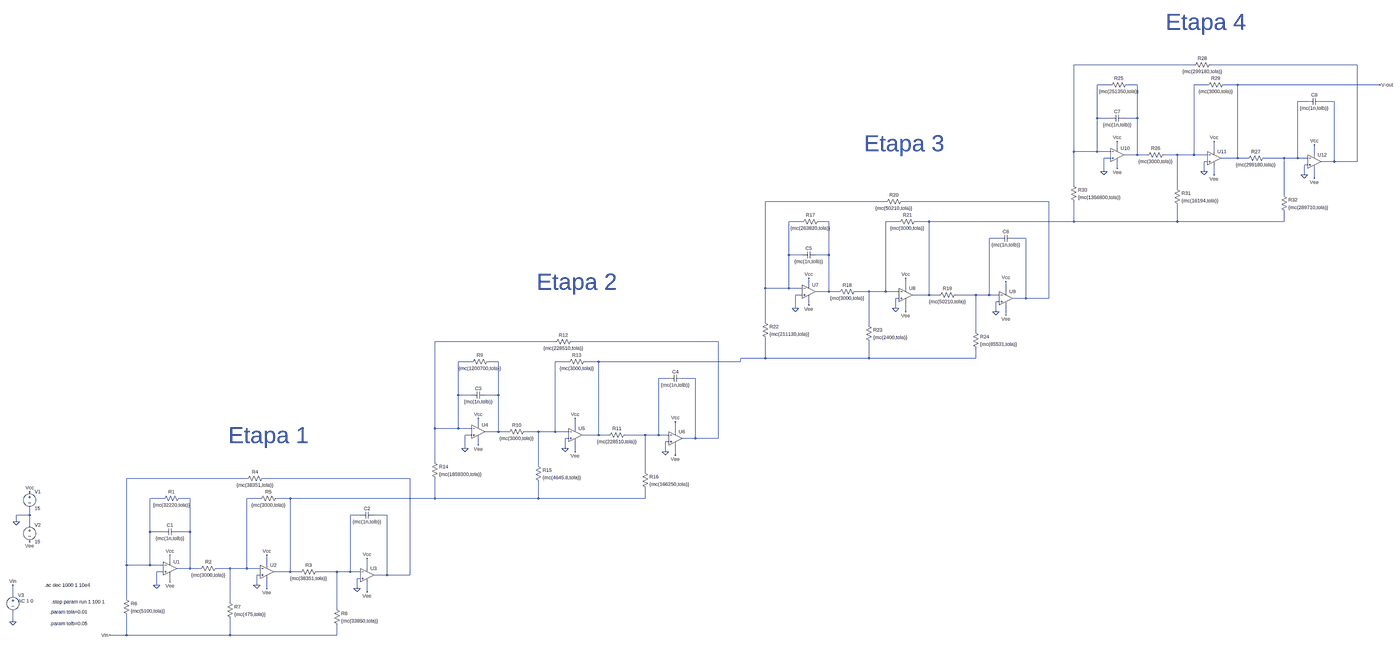
[diagram p0: schematic Draft1.asc, whole sheet]
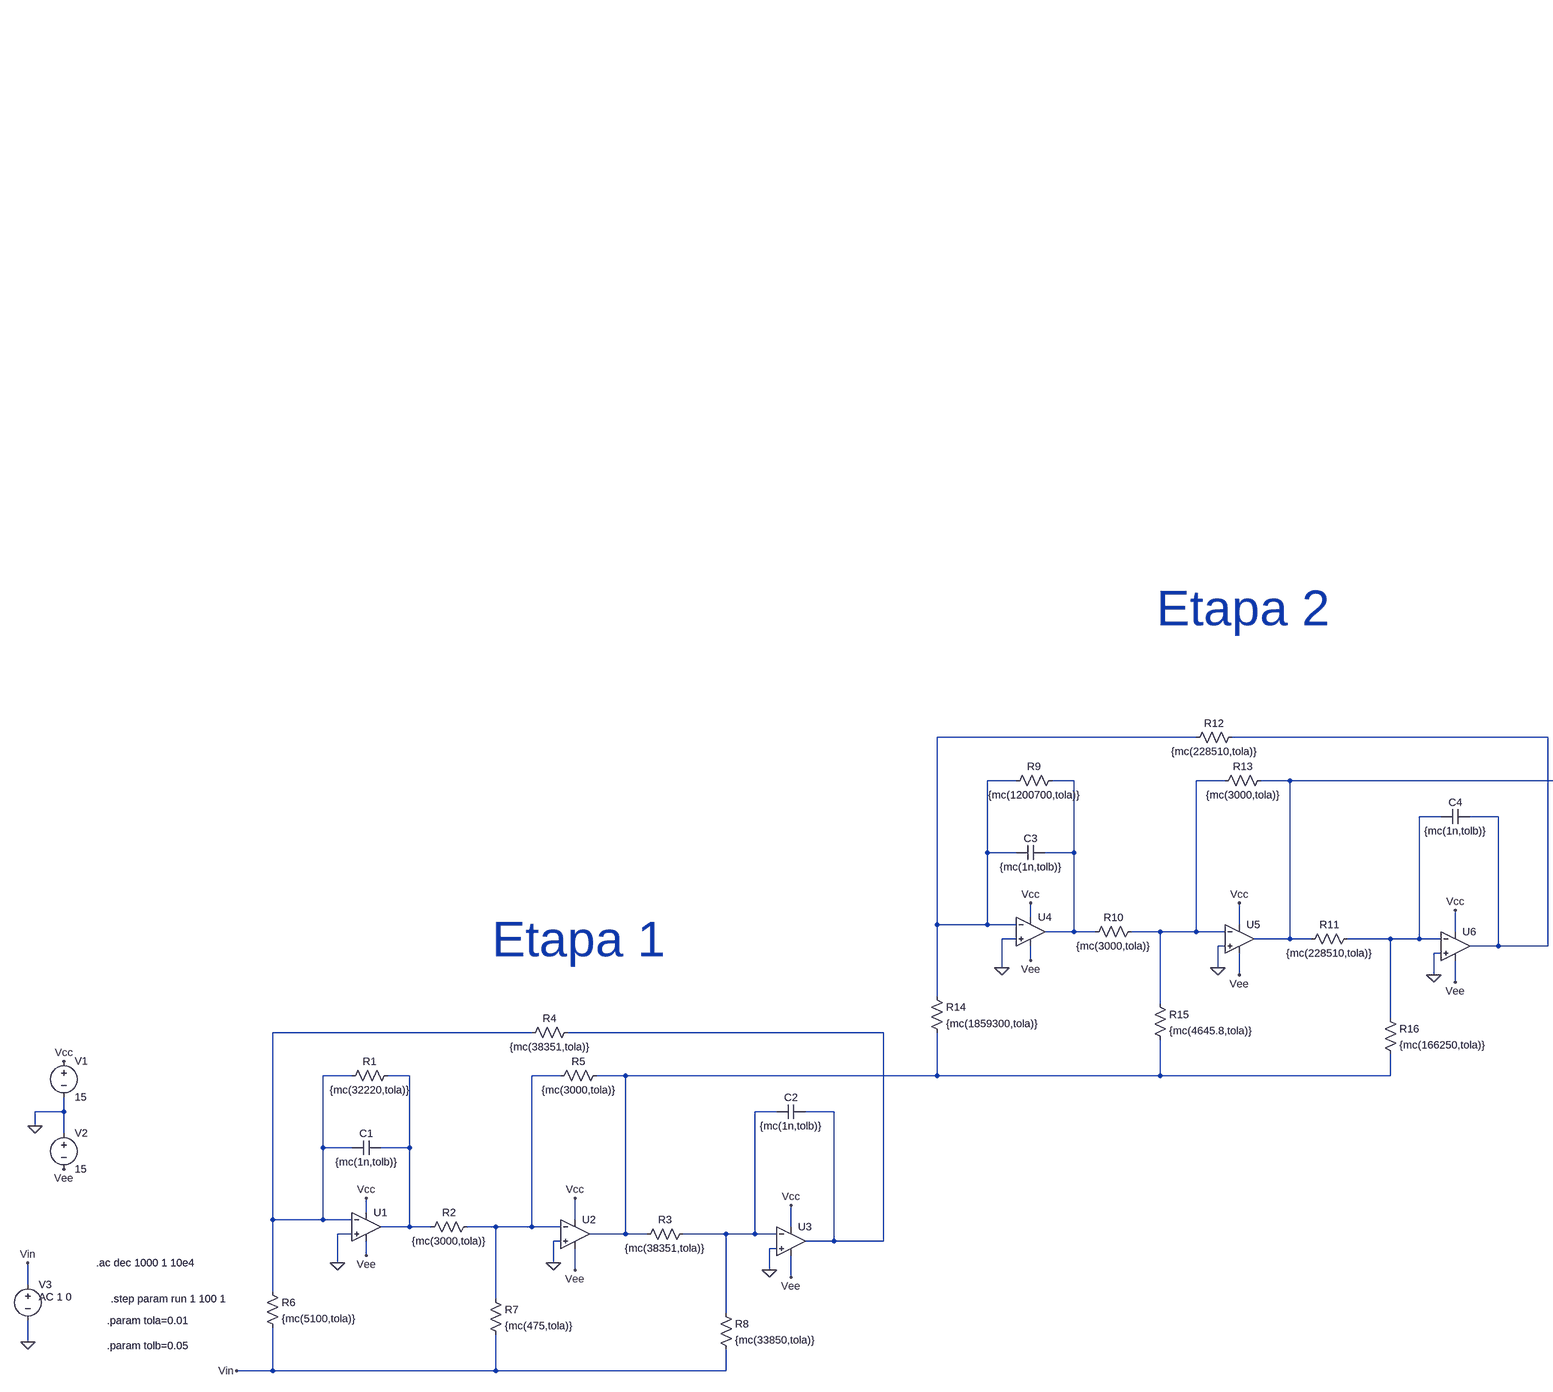
[diagram p1: schematic Draft1.asc, part, row 1 of 1, column 1 of 2]
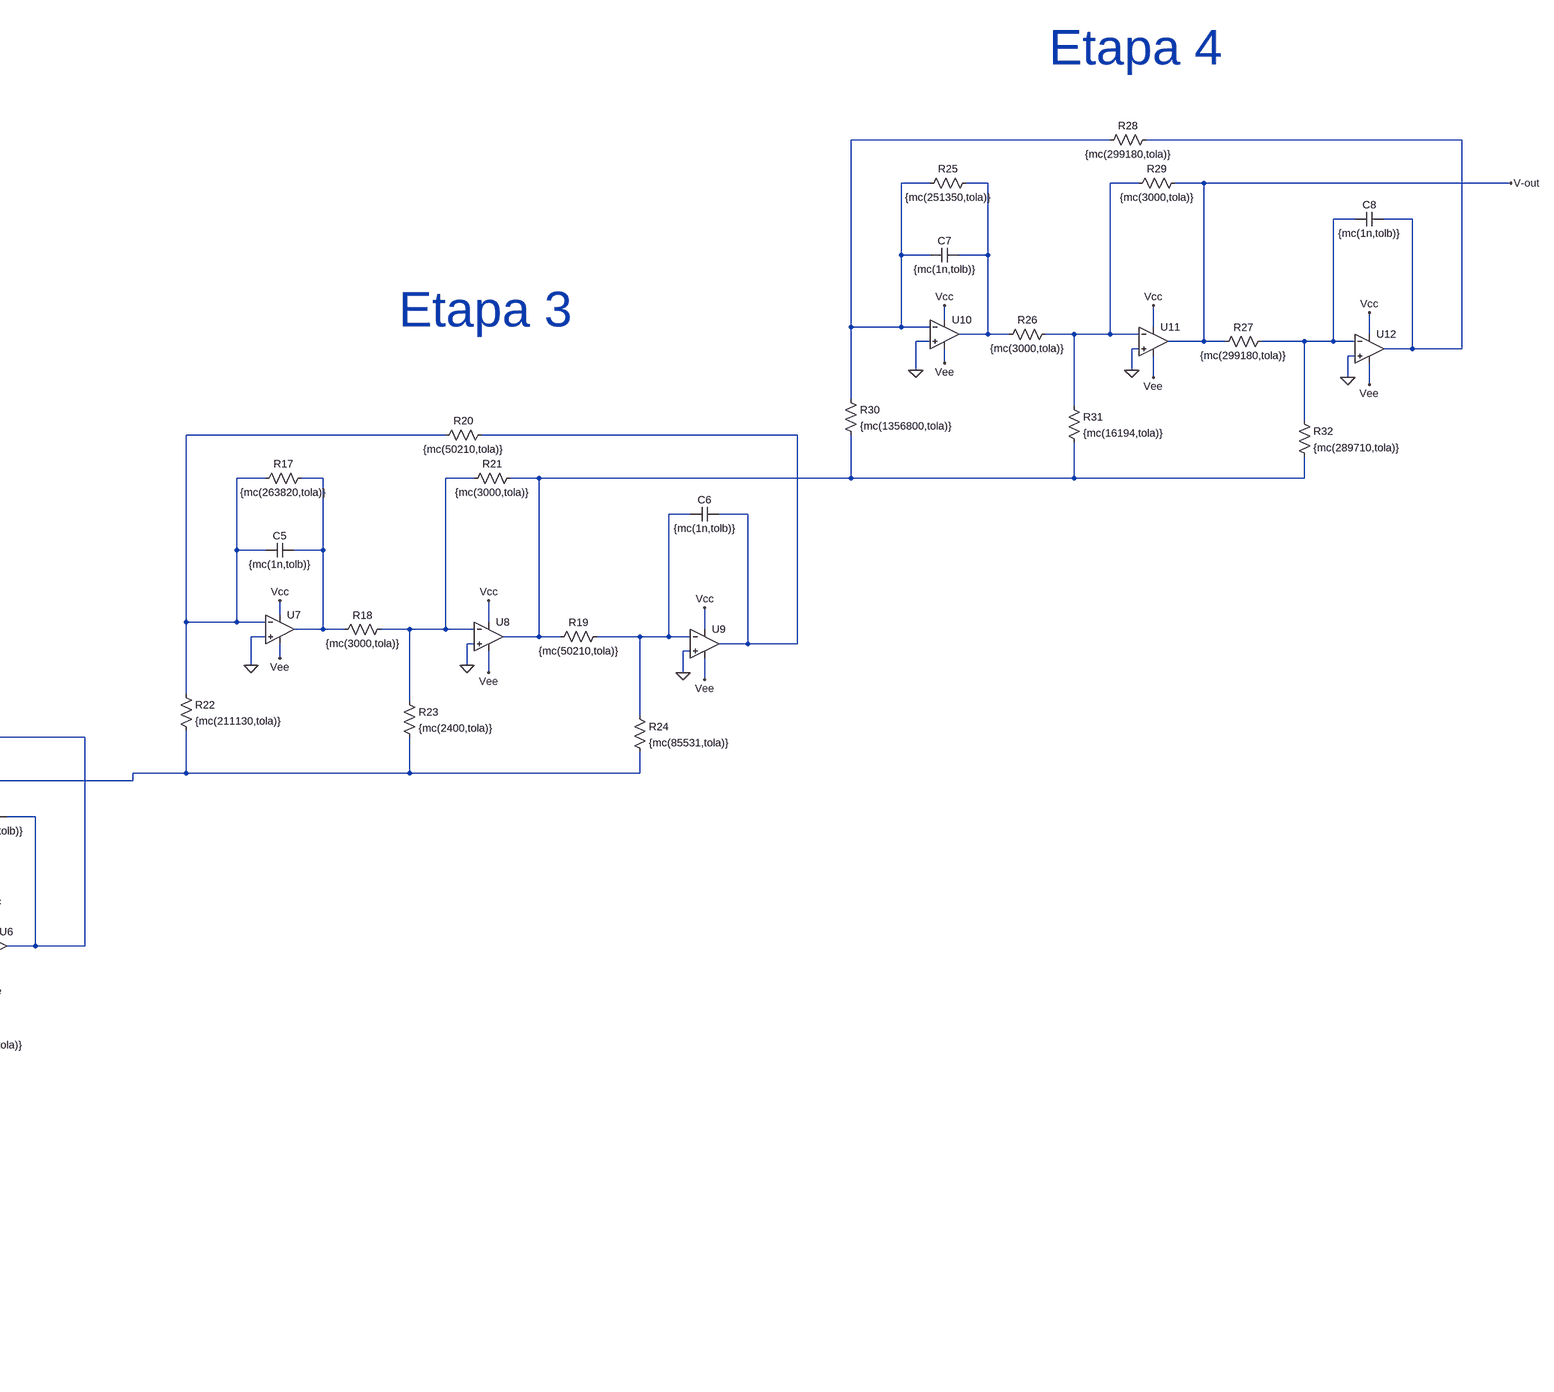
[diagram p2: schematic Draft1.asc, part, row 1 of 1, column 2 of 2]
Draft1.asc, the LTspice schematic file:
Version 4
SHEET 1 6620 1100
WIRE 5600 -1696 5024 -1696
WIRE 6400 -1696 5680 -1696
WIRE 5200 -1600 5136 -1600
WIRE 5328 -1600 5280 -1600
WIRE 5664 -1600 5600 -1600
WIRE 5808 -1600 5744 -1600
WIRE 6544 -1600 5808 -1600
WIRE 6144 -1520 6096 -1520
WIRE 6272 -1520 6208 -1520
WIRE 5136 -1440 5136 -1600
WIRE 5200 -1440 5136 -1440
WIRE 5328 -1440 5328 -1600
WIRE 5328 -1440 5264 -1440
WIRE 5232 -1296 5232 -1328
WIRE 5024 -1280 5024 -1696
WIRE 5136 -1280 5136 -1440
WIRE 5136 -1280 5024 -1280
WIRE 5200 -1280 5136 -1280
WIRE 5696 -1280 5696 -1328
WIRE 5328 -1264 5328 -1440
WIRE 5328 -1264 5264 -1264
WIRE 5376 -1264 5328 -1264
WIRE 5520 -1264 5456 -1264
WIRE 5600 -1264 5600 -1600
WIRE 5600 -1264 5520 -1264
WIRE 5664 -1264 5600 -1264
WIRE 6176 -1264 6176 -1312
WIRE 5200 -1248 5168 -1248
WIRE 5808 -1248 5808 -1600
WIRE 5808 -1248 5728 -1248
WIRE 5856 -1248 5808 -1248
WIRE 6032 -1248 5936 -1248
WIRE 6096 -1248 6096 -1520
WIRE 6096 -1248 6032 -1248
WIRE 6144 -1248 6096 -1248
WIRE 5664 -1232 5648 -1232
WIRE 6272 -1232 6272 -1520
WIRE 6272 -1232 6208 -1232
WIRE 6400 -1232 6400 -1696
WIRE 6400 -1232 6272 -1232
WIRE 6144 -1216 6128 -1216
WIRE 5232 -1200 5232 -1232
WIRE 5168 -1184 5168 -1248
WIRE 5648 -1184 5648 -1232
WIRE 5696 -1168 5696 -1216
WIRE 6128 -1168 6128 -1216
WIRE 6176 -1152 6176 -1200
WIRE 5024 -1120 5024 -1280
WIRE 5520 -1104 5520 -1264
WIRE 6032 -1072 6032 -1248
WIRE 3568 -1040 2992 -1040
WIRE 4368 -1040 3648 -1040
WIRE 3168 -944 3104 -944
WIRE 3296 -944 3248 -944
WIRE 3632 -944 3568 -944
WIRE 3776 -944 3712 -944
WIRE 5024 -944 5024 -1040
WIRE 5024 -944 3776 -944
WIRE 5520 -944 5520 -1024
WIRE 5520 -944 5024 -944
WIRE 6032 -944 6032 -992
WIRE 6032 -944 5520 -944
WIRE 4112 -864 4064 -864
WIRE 4240 -864 4176 -864
WIRE 3104 -784 3104 -944
WIRE 3168 -784 3104 -784
WIRE 3296 -784 3296 -944
WIRE 3296 -784 3232 -784
WIRE 3200 -640 3200 -672
WIRE 2992 -624 2992 -1040
WIRE 3104 -624 3104 -784
WIRE 3104 -624 2992 -624
WIRE 3168 -624 3104 -624
WIRE 3664 -624 3664 -672
WIRE 3296 -608 3296 -784
WIRE 3296 -608 3232 -608
WIRE 3344 -608 3296 -608
WIRE 3488 -608 3424 -608
WIRE 3568 -608 3568 -944
WIRE 3568 -608 3488 -608
WIRE 3632 -608 3568 -608
WIRE 4144 -608 4144 -656
WIRE 3168 -592 3136 -592
WIRE 3776 -592 3776 -944
WIRE 3776 -592 3696 -592
WIRE 3824 -592 3776 -592
WIRE 4000 -592 3904 -592
WIRE 4064 -592 4064 -864
WIRE 4064 -592 4000 -592
WIRE 4112 -592 4064 -592
WIRE 3632 -576 3616 -576
WIRE 4240 -576 4240 -864
WIRE 4240 -576 4176 -576
WIRE 4368 -576 4368 -1040
WIRE 4368 -576 4240 -576
WIRE 4112 -560 4096 -560
WIRE 3200 -544 3200 -576
WIRE 3136 -528 3136 -592
WIRE 3616 -528 3616 -576
WIRE 3664 -512 3664 -560
WIRE 4096 -512 4096 -560
WIRE 4144 -496 4144 -544
WIRE 2992 -464 2992 -624
WIRE 3488 -448 3488 -608
WIRE 4000 -416 4000 -592
WIRE 1440 -368 864 -368
WIRE 2240 -368 1520 -368
WIRE 2992 -288 2992 -384
WIRE 2992 -288 2512 -288
WIRE 3488 -288 3488 -368
WIRE 3488 -288 2992 -288
WIRE 4000 -288 4000 -336
WIRE 4000 -288 3488 -288
WIRE 1040 -272 976 -272
WIRE 1168 -272 1120 -272
WIRE 1504 -272 1440 -272
WIRE 1648 -272 1584 -272
WIRE 2512 -272 2512 -288
WIRE 2512 -272 1648 -272
WIRE 1984 -192 1936 -192
WIRE 2112 -192 2048 -192
WIRE 976 -112 976 -272
WIRE 1040 -112 976 -112
WIRE 1168 -112 1168 -272
WIRE 1168 -112 1104 -112
WIRE 1072 32 1072 0
WIRE 864 48 864 -368
WIRE 976 48 976 -112
WIRE 976 48 864 48
WIRE 1040 48 976 48
WIRE 1536 48 1536 0
WIRE 1168 64 1168 -112
WIRE 1168 64 1104 64
WIRE 1216 64 1168 64
WIRE 1360 64 1296 64
WIRE 1440 64 1440 -272
WIRE 1440 64 1360 64
WIRE 1504 64 1440 64
WIRE 2016 64 2016 16
WIRE 1040 80 1008 80
WIRE 1648 80 1648 -272
WIRE 1648 80 1568 80
WIRE 1696 80 1648 80
WIRE 1872 80 1776 80
WIRE 1936 80 1936 -192
WIRE 1936 80 1872 80
WIRE 1984 80 1936 80
WIRE 1504 96 1488 96
WIRE 2112 96 2112 -192
WIRE 2112 96 2048 96
WIRE 2240 96 2240 -368
WIRE 2240 96 2112 96
WIRE 1984 112 1968 112
WIRE 1072 128 1072 96
WIRE 1008 144 1008 80
WIRE 1488 144 1488 96
WIRE 1536 160 1536 112
WIRE 1968 160 1968 112
WIRE 2016 176 2016 128
WIRE 864 208 864 48
WIRE 1360 224 1360 64
WIRE 1872 256 1872 80
WIRE -800 288 -1376 288
WIRE 0 288 -720 288
WIRE -1200 384 -1264 384
WIRE -1072 384 -1120 384
WIRE -736 384 -800 384
WIRE -592 384 -656 384
WIRE 864 384 864 288
WIRE 864 384 -592 384
WIRE 1360 384 1360 304
WIRE 1360 384 864 384
WIRE 1872 384 1872 336
WIRE 1872 384 1360 384
WIRE -1840 464 -1840 432
WIRE -1840 464 -1904 464
WIRE -256 464 -304 464
WIRE -128 464 -192 464
WIRE -1904 496 -1904 464
WIRE -1840 512 -1840 464
WIRE -1264 544 -1264 384
WIRE -1200 544 -1264 544
WIRE -1072 544 -1072 384
WIRE -1072 544 -1136 544
WIRE -1168 688 -1168 656
WIRE -1376 704 -1376 288
WIRE -1264 704 -1264 544
WIRE -1264 704 -1376 704
WIRE -1200 704 -1264 704
WIRE -704 704 -704 656
WIRE -1072 720 -1072 544
WIRE -1072 720 -1136 720
WIRE -1024 720 -1072 720
WIRE -880 720 -944 720
WIRE -800 720 -800 384
WIRE -800 720 -880 720
WIRE -736 720 -800 720
WIRE -224 720 -224 672
WIRE -1200 736 -1232 736
WIRE -592 736 -592 384
WIRE -592 736 -672 736
WIRE -544 736 -592 736
WIRE -368 736 -464 736
WIRE -304 736 -304 464
WIRE -304 736 -368 736
WIRE -256 736 -304 736
WIRE -736 752 -752 752
WIRE -128 752 -128 464
WIRE -128 752 -192 752
WIRE 0 752 0 288
WIRE 0 752 -128 752
WIRE -256 768 -272 768
WIRE -1168 784 -1168 752
WIRE -1232 800 -1232 736
WIRE -752 800 -752 752
WIRE -704 816 -704 768
WIRE -272 816 -272 768
WIRE -224 832 -224 784
WIRE -1920 848 -1920 800
WIRE -1376 864 -1376 704
WIRE -880 880 -880 720
WIRE -368 912 -368 736
WIRE -1920 976 -1920 928
WIRE -1376 1040 -1376 944
WIRE -1376 1040 -1456 1040
WIRE -880 1040 -880 960
WIRE -880 1040 -1376 1040
WIRE -368 1040 -368 992
WIRE -368 1040 -880 1040
FLAG -272 816 0
FLAG -752 800 0
FLAG -1168 656 Vcc
FLAG -704 656 Vcc
FLAG -224 672 Vcc
FLAG -1168 784 Vee
FLAG -704 816 Vee
FLAG -224 832 Vee
FLAG -1840 352 Vcc
FLAG -1840 592 Vee
FLAG -1904 496 0
FLAG -1920 976 0
FLAG -1920 800 Vin
FLAG -1232 800 0
FLAG -1456 1040 Vin
FLAG 1968 160 0
FLAG 1488 144 0
FLAG 1072 0 Vcc
FLAG 1536 0 Vcc
FLAG 2016 16 Vcc
FLAG 1072 128 Vee
FLAG 1536 160 Vee
FLAG 2016 176 Vee
FLAG 1008 144 0
FLAG 4096 -512 0
FLAG 3616 -528 0
FLAG 3200 -672 Vcc
FLAG 3664 -672 Vcc
FLAG 4144 -656 Vcc
FLAG 3200 -544 Vee
FLAG 3664 -512 Vee
FLAG 4144 -496 Vee
FLAG 3136 -528 0
FLAG 6128 -1168 0
FLAG 5648 -1184 0
FLAG 6544 -1600 V-out
FLAG 5232 -1328 Vcc
FLAG 5696 -1328 Vcc
FLAG 6176 -1312 Vcc
FLAG 5232 -1200 Vee
FLAG 5696 -1168 Vee
FLAG 6176 -1152 Vee
FLAG 5168 -1184 0
SYMBOL Opamps\\UniversalOpamp2 -1168 720 R0
SYMATTR InstName U1
SYMATTR Value2 Avol=1000Meg GBW=10000Meg Slew=1000Meg
SYMATTR SpiceLine ilimit=50 rail=0 Vos=0 phimargin=45
SYMATTR SpiceLine2 en=0 enk=0 in=0 ink=0 Rin=100000Meg
SYMBOL Opamps\\UniversalOpamp2 -704 736 R0
SYMATTR InstName U2
SYMATTR Value2 Avol=1000Meg GBW=10000Meg Slew=1000Meg
SYMATTR SpiceLine ilimit=50 rail=0 Vos=0 phimargin=45
SYMATTR SpiceLine2 en=0 enk=0 in=0 ink=0 Rin=100000Meg
SYMBOL Opamps\\UniversalOpamp2 -224 752 R0
SYMATTR InstName U3
SYMATTR Value2 Avol=1000Meg GBW=10000Meg Slew=1000Meg
SYMATTR SpiceLine ilimit=50 rail=0 Vos=0 phimargin=45
SYMATTR SpiceLine2 en=0 enk=0 in=0 ink=0 Rin=100000Meg
SYMBOL res -1104 368 R90
WINDOW 0 0 56 VBottom 2
WINDOW 3 32 56 VTop 2
SYMATTR InstName R1
SYMATTR Value {mc(32220,tola)}
SYMBOL res -928 704 R90
WINDOW 0 0 56 VBottom 2
WINDOW 3 32 56 VTop 2
SYMATTR InstName R2
SYMATTR Value {mc(3000,tola)}
SYMBOL res -448 720 R90
WINDOW 0 0 56 VBottom 2
WINDOW 3 32 56 VTop 2
SYMATTR InstName R3
SYMATTR Value {mc(38351,tola)}
SYMBOL voltage -1840 336 R0
WINDOW 123 0 0 Left 2
WINDOW 39 0 0 Left 2
SYMATTR InstName V1
SYMATTR Value 15
SYMBOL voltage -1840 496 R0
WINDOW 123 0 0 Left 2
WINDOW 39 0 0 Left 2
SYMATTR InstName V2
SYMATTR Value 15
SYMBOL voltage -1920 832 R0
WINDOW 123 24 44 Left 2
WINDOW 39 0 0 Left 2
SYMATTR Value2 AC 1 0
SYMATTR InstName V3
SYMATTR Value ""
SYMBOL cap -1136 528 R90
WINDOW 0 0 32 VBottom 2
WINDOW 3 32 32 VTop 2
SYMATTR InstName C1
SYMATTR Value {mc(1n,tolb)}
SYMBOL res -704 272 R90
WINDOW 0 0 56 VBottom 2
WINDOW 3 32 56 VTop 2
SYMATTR InstName R4
SYMATTR Value {mc(38351,tola)}
SYMBOL res -640 368 R90
WINDOW 0 0 56 VBottom 2
WINDOW 3 32 56 VTop 2
SYMATTR InstName R5
SYMATTR Value {mc(3000,tola)}
SYMBOL cap -192 448 R90
WINDOW 0 0 32 VBottom 2
WINDOW 3 32 32 VTop 2
SYMATTR InstName C2
SYMATTR Value {mc(1n,tolb)}
SYMBOL res -1392 848 R0
SYMATTR InstName R6
SYMATTR Value {mc(5100,tola)}
SYMBOL res -896 864 R0
SYMATTR InstName R7
SYMATTR Value {mc(475,tola)}
SYMBOL res -384 896 R0
SYMATTR InstName R8
SYMATTR Value {mc(33850,tola)}
SYMBOL Opamps\\UniversalOpamp2 1072 64 R0
SYMATTR InstName U4
SYMATTR Value2 Avol=1000Meg GBW=10000Meg Slew=1000Meg
SYMATTR SpiceLine ilimit=50 rail=0 Vos=0 phimargin=45
SYMATTR SpiceLine2 en=0 enk=0 in=0 ink=0 Rin=100000Meg
SYMBOL Opamps\\UniversalOpamp2 1536 80 R0
SYMATTR InstName U5
SYMATTR Value2 Avol=1000Meg GBW=10000Meg Slew=1000Meg
SYMATTR SpiceLine ilimit=50 rail=0 Vos=0 phimargin=45
SYMATTR SpiceLine2 en=0 enk=0 in=0 ink=0 Rin=100000Meg
SYMBOL Opamps\\UniversalOpamp2 2016 96 R0
SYMATTR InstName U6
SYMATTR Value2 Avol=1000Meg GBW=10000Meg Slew=1000Meg
SYMATTR SpiceLine ilimit=50 rail=0 Vos=0 phimargin=45
SYMATTR SpiceLine2 en=0 enk=0 in=0 ink=0 Rin=100000Meg
SYMBOL res 1136 -288 R90
WINDOW 0 0 56 VBottom 2
WINDOW 3 32 56 VTop 2
SYMATTR InstName R9
SYMATTR Value {mc(1200700,tola)}
SYMBOL res 1312 48 R90
WINDOW 0 0 56 VBottom 2
WINDOW 3 32 56 VTop 2
SYMATTR InstName R10
SYMATTR Value {mc(3000,tola)}
SYMBOL res 1792 64 R90
WINDOW 0 0 56 VBottom 2
WINDOW 3 32 56 VTop 2
SYMATTR InstName R11
SYMATTR Value {mc(228510,tola)}
SYMBOL cap 1104 -128 R90
WINDOW 0 0 32 VBottom 2
WINDOW 3 32 32 VTop 2
SYMATTR InstName C3
SYMATTR Value {mc(1n,tolb)}
SYMBOL res 1536 -384 R90
WINDOW 0 0 56 VBottom 2
WINDOW 3 32 56 VTop 2
SYMATTR InstName R12
SYMATTR Value {mc(228510,tola)}
SYMBOL res 1600 -288 R90
WINDOW 0 0 56 VBottom 2
WINDOW 3 32 56 VTop 2
SYMATTR InstName R13
SYMATTR Value {mc(3000,tola)}
SYMBOL cap 2048 -208 R90
WINDOW 0 0 32 VBottom 2
WINDOW 3 32 32 VTop 2
SYMATTR InstName C4
SYMATTR Value {mc(1n,tolb)}
SYMBOL res 848 192 R0
SYMATTR InstName R14
SYMATTR Value {mc(1859300,tola)}
SYMBOL res 1344 208 R0
SYMATTR InstName R15
SYMATTR Value {mc(4645.8,tola)}
SYMBOL res 1856 240 R0
SYMATTR InstName R16
SYMATTR Value {mc(166250,tola)}
SYMBOL Opamps\\UniversalOpamp2 3200 -608 R0
SYMATTR InstName U7
SYMATTR Value2 Avol=1000Meg GBW=10000Meg Slew=1000Meg
SYMATTR SpiceLine ilimit=50 rail=0 Vos=0 phimargin=45
SYMATTR SpiceLine2 en=0 enk=0 in=0 ink=0 Rin=100000Meg
SYMBOL Opamps\\UniversalOpamp2 3664 -592 R0
SYMATTR InstName U8
SYMATTR Value2 Avol=1000Meg GBW=10000Meg Slew=1000Meg
SYMATTR SpiceLine ilimit=50 rail=0 Vos=0 phimargin=45
SYMATTR SpiceLine2 en=0 enk=0 in=0 ink=0 Rin=100000Meg
SYMBOL Opamps\\UniversalOpamp2 4144 -576 R0
SYMATTR InstName U9
SYMATTR Value2 Avol=1000Meg GBW=10000Meg Slew=1000Meg
SYMATTR SpiceLine ilimit=50 rail=0 Vos=0 phimargin=45
SYMATTR SpiceLine2 en=0 enk=0 in=0 ink=0 Rin=100000Meg
SYMBOL res 3264 -960 R90
WINDOW 0 0 56 VBottom 2
WINDOW 3 32 56 VTop 2
SYMATTR InstName R17
SYMATTR Value {mc(263820,tola)}
SYMBOL res 3440 -624 R90
WINDOW 0 0 56 VBottom 2
WINDOW 3 32 56 VTop 2
SYMATTR InstName R18
SYMATTR Value {mc(3000,tola)}
SYMBOL res 3920 -608 R90
WINDOW 0 0 56 VBottom 2
WINDOW 3 32 56 VTop 2
SYMATTR InstName R19
SYMATTR Value {mc(50210,tola)}
SYMBOL cap 3232 -800 R90
WINDOW 0 0 32 VBottom 2
WINDOW 3 32 32 VTop 2
SYMATTR InstName C5
SYMATTR Value {mc(1n,tolb)}
SYMBOL res 3664 -1056 R90
WINDOW 0 0 56 VBottom 2
WINDOW 3 32 56 VTop 2
SYMATTR InstName R20
SYMATTR Value {mc(50210,tola)}
SYMBOL res 3728 -960 R90
WINDOW 0 0 56 VBottom 2
WINDOW 3 32 56 VTop 2
SYMATTR InstName R21
SYMATTR Value {mc(3000,tola)}
SYMBOL cap 4176 -880 R90
WINDOW 0 0 32 VBottom 2
WINDOW 3 32 32 VTop 2
SYMATTR InstName C6
SYMATTR Value {mc(1n,tolb)}
SYMBOL res 2976 -480 R0
SYMATTR InstName R22
SYMATTR Value {mc(211130,tola)}
SYMBOL res 3472 -464 R0
SYMATTR InstName R23
SYMATTR Value {mc(2400,tola)}
SYMBOL res 3984 -432 R0
SYMATTR InstName R24
SYMATTR Value {mc(85531,tola)}
SYMBOL Opamps\\UniversalOpamp2 5232 -1264 R0
SYMATTR InstName U10
SYMATTR Value2 Avol=1000Meg GBW=10000Meg Slew=1000Meg
SYMATTR SpiceLine ilimit=50 rail=0 Vos=0 phimargin=45
SYMATTR SpiceLine2 en=0 enk=0 in=0 ink=0 Rin=100000Meg
SYMBOL Opamps\\UniversalOpamp2 5696 -1248 R0
SYMATTR InstName U11
SYMATTR Value2 Avol=1000Meg GBW=10000Meg Slew=1000Meg
SYMATTR SpiceLine ilimit=50 rail=0 Vos=0 phimargin=45
SYMATTR SpiceLine2 en=0 enk=0 in=0 ink=0 Rin=100000Meg
SYMBOL Opamps\\UniversalOpamp2 6176 -1232 R0
SYMATTR InstName U12
SYMATTR Value2 Avol=1000Meg GBW=10000Meg Slew=1000Meg
SYMATTR SpiceLine ilimit=50 rail=0 Vos=0 phimargin=45
SYMATTR SpiceLine2 en=0 enk=0 in=0 ink=0 Rin=100000Meg
SYMBOL res 5296 -1616 R90
WINDOW 0 0 56 VBottom 2
WINDOW 3 32 56 VTop 2
SYMATTR InstName R25
SYMATTR Value {mc(251350,tola)}
SYMBOL res 5472 -1280 R90
WINDOW 0 0 56 VBottom 2
WINDOW 3 32 56 VTop 2
SYMATTR InstName R26
SYMATTR Value {mc(3000,tola)}
SYMBOL res 5952 -1264 R90
WINDOW 0 0 56 VBottom 2
WINDOW 3 32 56 VTop 2
SYMATTR InstName R27
SYMATTR Value {mc(299180,tola)}
SYMBOL cap 5264 -1456 R90
WINDOW 0 0 32 VBottom 2
WINDOW 3 32 32 VTop 2
SYMATTR InstName C7
SYMATTR Value {mc(1n,tolb)}
SYMBOL res 5696 -1712 R90
WINDOW 0 0 56 VBottom 2
WINDOW 3 32 56 VTop 2
SYMATTR InstName R28
SYMATTR Value {mc(299180,tola)}
SYMBOL res 5760 -1616 R90
WINDOW 0 0 56 VBottom 2
WINDOW 3 32 56 VTop 2
SYMATTR InstName R29
SYMATTR Value {mc(3000,tola)}
SYMBOL cap 6208 -1536 R90
WINDOW 0 0 32 VBottom 2
WINDOW 3 32 32 VTop 2
SYMATTR InstName C8
SYMATTR Value {mc(1n,tolb)}
SYMBOL res 5008 -1136 R0
SYMATTR InstName R30
SYMATTR Value {mc(1356800,tola)}
SYMBOL res 5504 -1120 R0
SYMATTR InstName R31
SYMATTR Value {mc(16194,tola)}
SYMBOL res 6016 -1088 R0
SYMATTR InstName R32
SYMATTR Value {mc(289710,tola)}
TEXT -1768 800 Left 2 !.ac dec 1000 1 10e4
TEXT -1736 880 Left 2 !.step param run 1 100 1
TEXT -1744 928 Left 2 !.param tola=0.01
TEXT -1744 984 Left 2 !.param tolb=0.05
TEXT -888 80 Left 7 ;Etapa 1
TEXT 1352 -656 Left 7 ;Etapa 2
TEXT 3464 -1320 Left 7 ;Etapa 3
TEXT 5464 -1944 Left 7 ;Etapa 4

The netlist it stands for:
* Draft1.asc
XU1 0 N018 Vcc Vee N020 level.2 Avol=1000Meg GBW=10000Meg Slew=1000Meg ilimit=50 rail=0 Vos=0 phimargin=45 en=0 enk=0 in=0 ink=0 Rin=100000Meg  ; pins IN+ IN- V+ V- OUT
XU2 0 N021 Vcc Vee N022 level.2 Avol=1000Meg GBW=10000Meg Slew=1000Meg ilimit=50 rail=0 Vos=0 phimargin=45 en=0 enk=0 in=0 ink=0 Rin=100000Meg  ; pins IN+ IN- V+ V- OUT
XU3 0 N023 Vcc Vee N019 level.2 Avol=1000Meg GBW=10000Meg Slew=1000Meg ilimit=50 rail=0 Vos=0 phimargin=45 en=0 enk=0 in=0 ink=0 Rin=100000Meg  ; pins IN+ IN- V+ V- OUT
R1 N020 N018 {mc(32220,tola)}
R2 N021 N020 {mc(3000,tola)}
R3 N023 N022 {mc(38351,tola)}
V1 Vcc 0 15
V2 0 Vee 15
V3 Vin 0 AC 1 0
C1 N020 N018 {mc(1n,tolb)}
R4 N019 N018 {mc(38351,tola)}
R5 N022 N021 {mc(3000,tola)}
C2 N019 N023 {mc(1n,tolb)}
R6 N018 Vin {mc(5100,tola)}
R7 N021 Vin {mc(475,tola)}
R8 N023 Vin {mc(33850,tola)}
XU4 0 N012 Vcc Vee N015 level.2 Avol=1000Meg GBW=10000Meg Slew=1000Meg ilimit=50 rail=0 Vos=0 phimargin=45 en=0 enk=0 in=0 ink=0 Rin=100000Meg  ; pins IN+ IN- V+ V- OUT
XU5 0 N016 Vcc Vee N014 level.2 Avol=1000Meg GBW=10000Meg Slew=1000Meg ilimit=50 rail=0 Vos=0 phimargin=45 en=0 enk=0 in=0 ink=0 Rin=100000Meg  ; pins IN+ IN- V+ V- OUT
XU6 0 N017 Vcc Vee N013 level.2 Avol=1000Meg GBW=10000Meg Slew=1000Meg ilimit=50 rail=0 Vos=0 phimargin=45 en=0 enk=0 in=0 ink=0 Rin=100000Meg  ; pins IN+ IN- V+ V- OUT
R9 N015 N012 {mc(1200700,tola)}
R10 N016 N015 {mc(3000,tola)}
R11 N017 N014 {mc(228510,tola)}
C3 N015 N012 {mc(1n,tolb)}
R12 N013 N012 {mc(228510,tola)}
R13 N014 N016 {mc(3000,tola)}
C4 N013 N017 {mc(1n,tolb)}
R14 N012 N022 {mc(1859300,tola)}
R15 N016 N022 {mc(4645.8,tola)}
R16 N017 N022 {mc(166250,tola)}
XU7 0 N006 Vcc Vee N008 level.2 Avol=1000Meg GBW=10000Meg Slew=1000Meg ilimit=50 rail=0 Vos=0 phimargin=45 en=0 enk=0 in=0 ink=0 Rin=100000Meg  ; pins IN+ IN- V+ V- OUT
XU8 0 N009 Vcc Vee N010 level.2 Avol=1000Meg GBW=10000Meg Slew=1000Meg ilimit=50 rail=0 Vos=0 phimargin=45 en=0 enk=0 in=0 ink=0 Rin=100000Meg  ; pins IN+ IN- V+ V- OUT
XU9 0 N011 Vcc Vee N007 level.2 Avol=1000Meg GBW=10000Meg Slew=1000Meg ilimit=50 rail=0 Vos=0 phimargin=45 en=0 enk=0 in=0 ink=0 Rin=100000Meg  ; pins IN+ IN- V+ V- OUT
R17 N008 N006 {mc(263820,tola)}
R18 N009 N008 {mc(3000,tola)}
R19 N011 N010 {mc(50210,tola)}
C5 N008 N006 {mc(1n,tolb)}
R20 N007 N006 {mc(50210,tola)}
R21 N010 N009 {mc(3000,tola)}
C6 N007 N011 {mc(1n,tolb)}
R22 N006 N014 {mc(211130,tola)}
R23 N009 N014 {mc(2400,tola)}
R24 N011 N014 {mc(85531,tola)}
XU10 0 N001 Vcc Vee N003 level.2 Avol=1000Meg GBW=10000Meg Slew=1000Meg ilimit=50 rail=0 Vos=0 phimargin=45 en=0 enk=0 in=0 ink=0 Rin=100000Meg  ; pins IN+ IN- V+ V- OUT
XU11 0 N004 Vcc Vee V-out level.2 Avol=1000Meg GBW=10000Meg Slew=1000Meg ilimit=50 rail=0 Vos=0 phimargin=45 en=0 enk=0 in=0 ink=0 Rin=100000Meg  ; pins IN+ IN- V+ V- OUT
XU12 0 N005 Vcc Vee N002 level.2 Avol=1000Meg GBW=10000Meg Slew=1000Meg ilimit=50 rail=0 Vos=0 phimargin=45 en=0 enk=0 in=0 ink=0 Rin=100000Meg  ; pins IN+ IN- V+ V- OUT
R25 N003 N001 {mc(251350,tola)}
R26 N004 N003 {mc(3000,tola)}
R27 N005 V-out {mc(299180,tola)}
C7 N003 N001 {mc(1n,tolb)}
R28 N002 N001 {mc(299180,tola)}
R29 V-out N004 {mc(3000,tola)}
C8 N002 N005 {mc(1n,tolb)}
R30 N001 N010 {mc(1356800,tola)}
R31 N004 N010 {mc(16194,tola)}
R32 N005 N010 {mc(289710,tola)}
.ac dec 1000 1 10e4
.step param run 1 100 1
.param tola=0.01
.param tolb=0.05
* Etapa 1
* Etapa 2
* Etapa 3
* Etapa 4
.lib UniversalOpamps2.sub
.backanno
.end